# EAGLE board mainboard edited newer edit removed most of the synth (EAGLE 9.5.0)
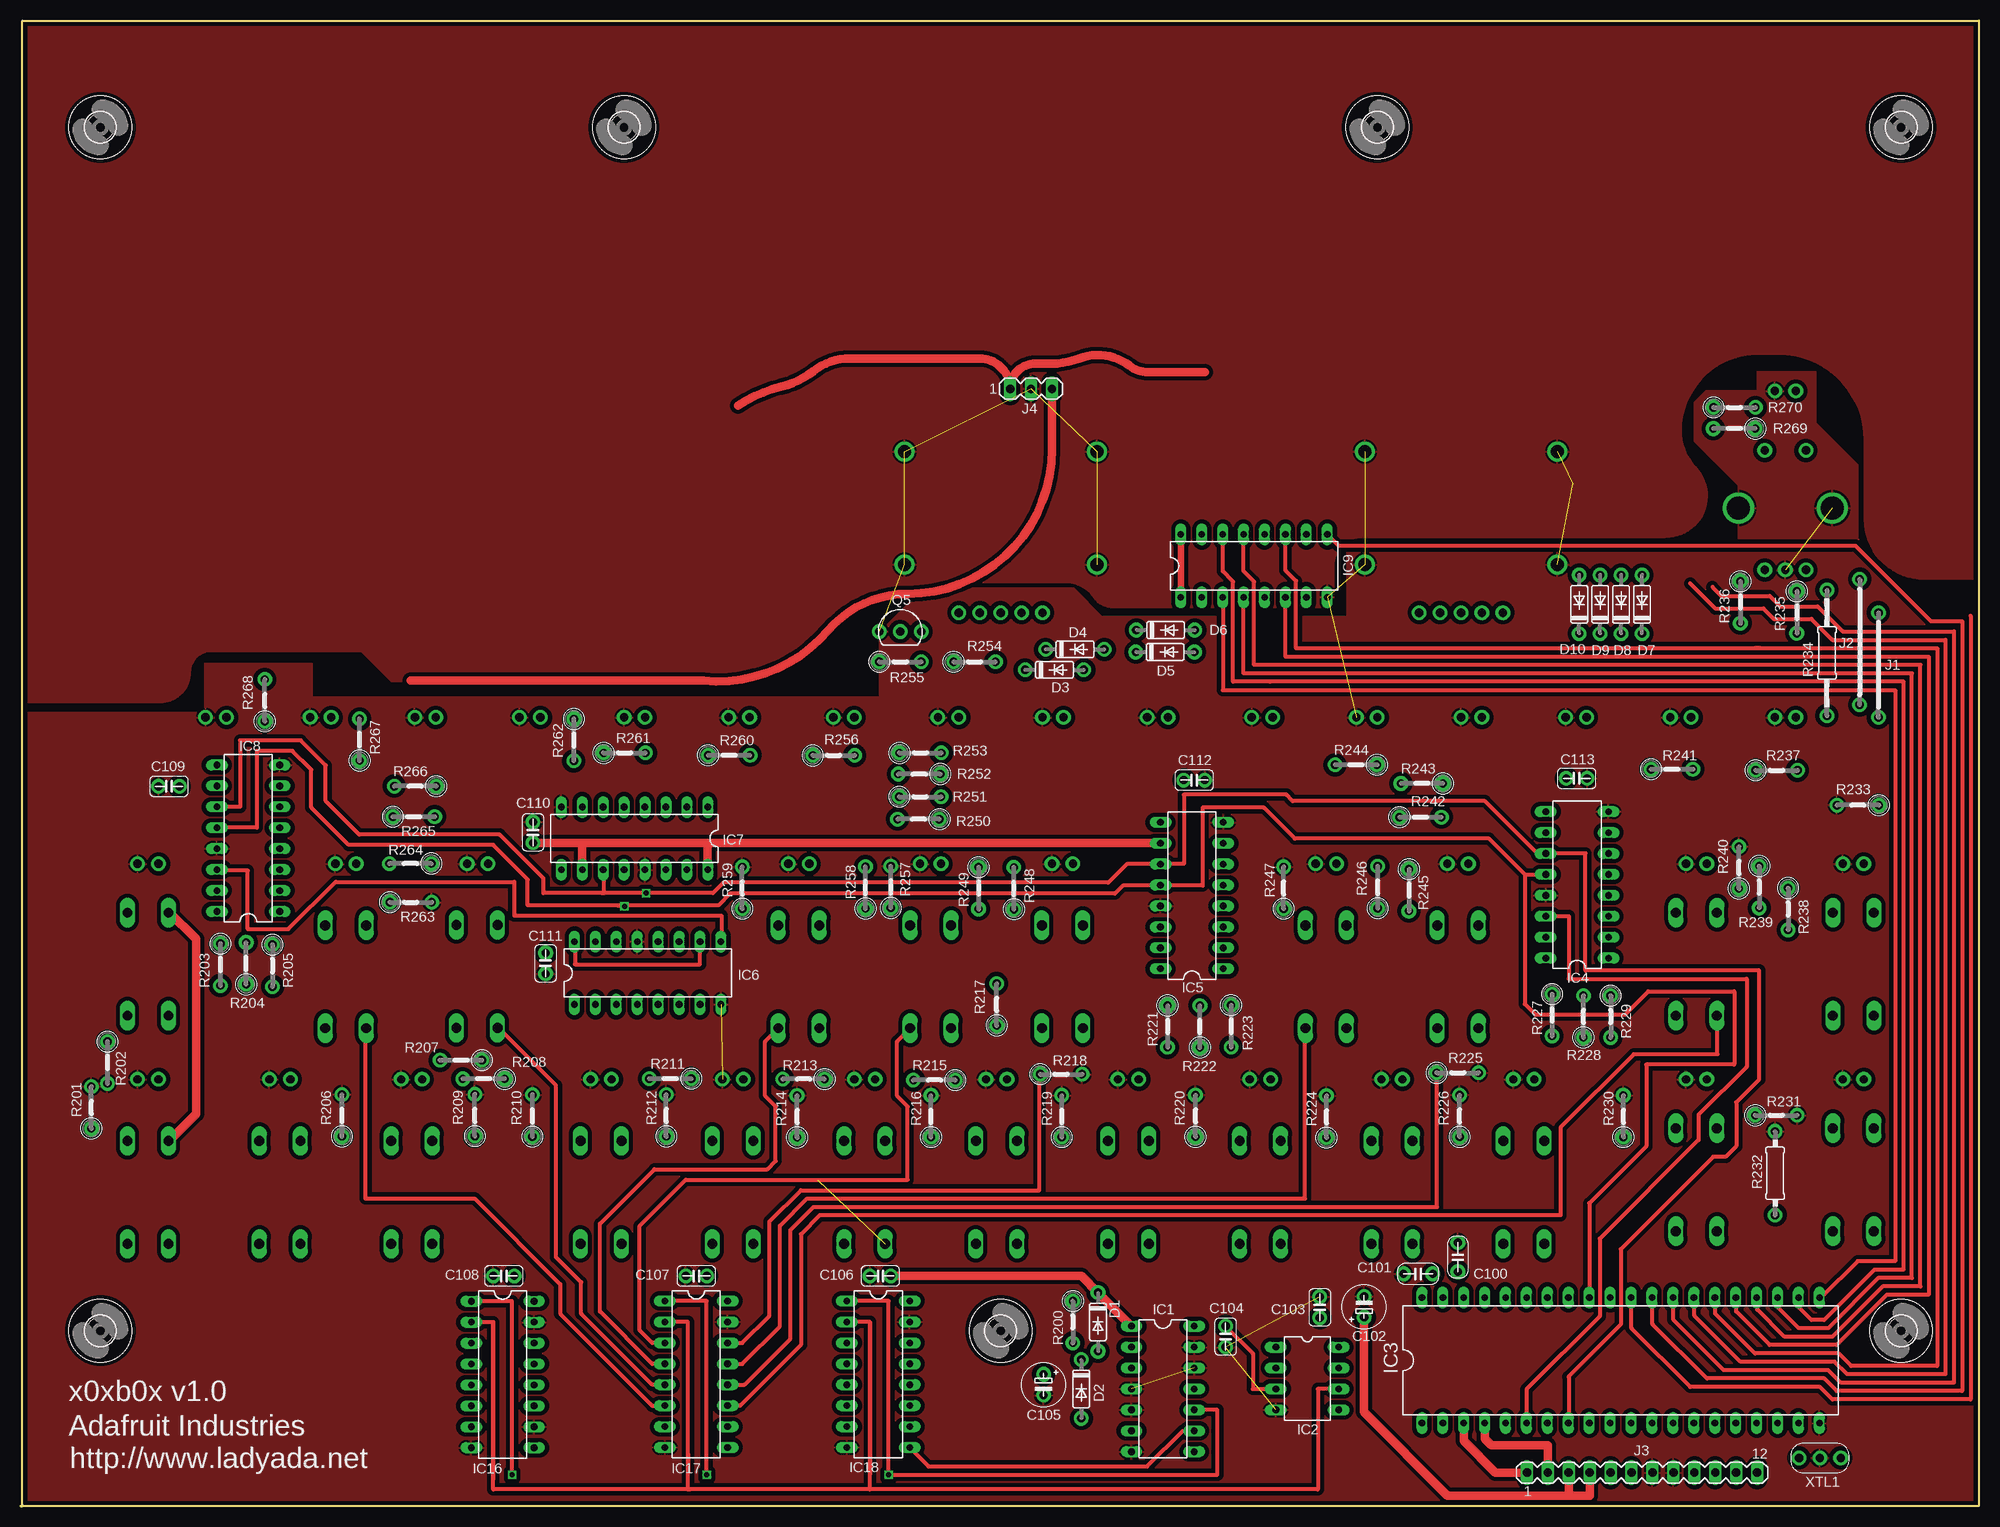
[diagram p3: board, top side]
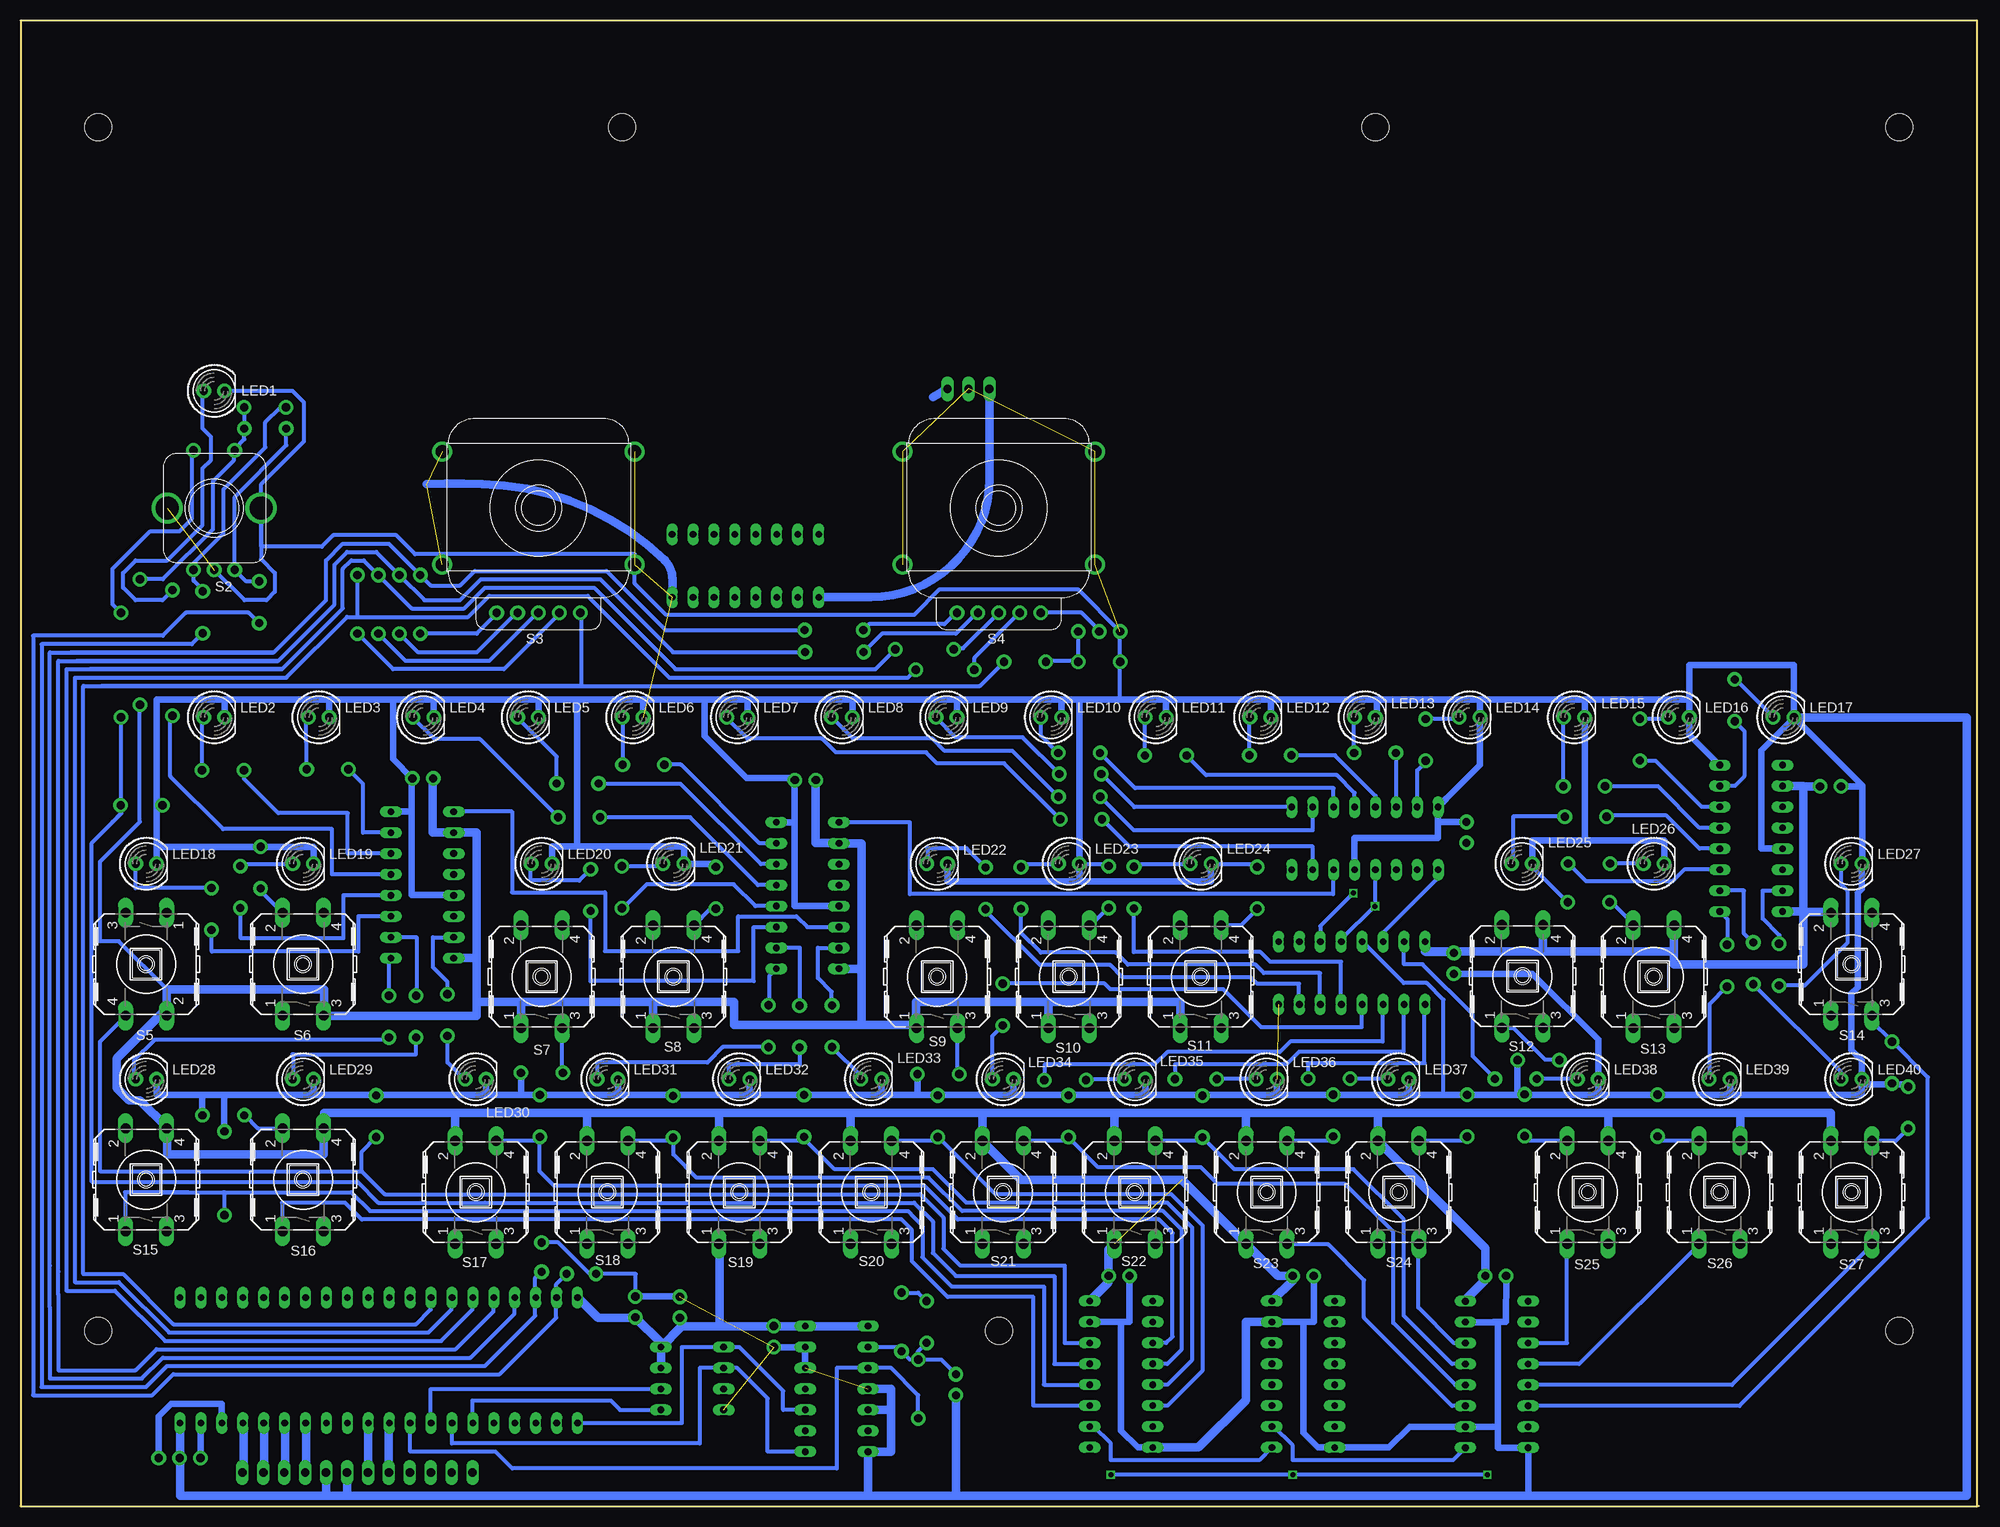
[diagram p4: board, bottom side, seen from below]

Size 237.72 x 180.34 mm. Coordinates in mm from the lower left corner, seen from the top.
Outline: 0.23,0 0.23,180.34 237.72,180.34 237.72,0 0.2,0
Outline: 0,0 0.2,0
Outline: 0.2,0 0.2,0.18
Copper layers (1*16): Top 0.035mm / dielectric 1.5mm / Bottom 0.035mm
Design rules "default": minimum track width 10mil, minimum drill 20mil, track to track 10mil, track to pad 10mil, pad to pad 10mil, via to via 10mil, smd to smd 10mil, copper to edge 10mil, drill to drill 10mil, minimum pad ring 10mil, minimum via ring 8mil, stop-mask expansion 4mil, vias tented up to drill 0mil, thermal gap 10mil

## Footprints (pad centres in the part's own frame; a part is rotated, then mirrored left to right if it is on the bottom)
C050-035X075 = drill 1 pad 1.778: 1 -1.778,0; 2 1.778,0
E5-6 = drill 1 pad 1.778: + -1.27,0; - 1.27,0
C050H075X075 = drill 1 pad 1.778: 1 -1.27,0; 2 1.27,0
DO35-10 = drill 1 pad 1.778: A 3.556,0; C -3.556,0
DIL14 = drill 0.813 long: 1 -7.62,-3.81; 2 -5.08,-3.81; 3 -2.54,-3.81; 4 0,-3.81; 5 2.54,-3.81; 6 5.08,-3.81; 7 7.62,-3.81; 8 7.62,3.81; 9 5.08,3.81; 10 2.54,3.81; 11 0,3.81; 12 -2.54,3.81; 13 -5.08,3.81; 14 -7.62,3.81
DIL08 = drill 0.813 long: 1 -3.81,-3.81; 2 -1.27,-3.81; 3 1.27,-3.81; 4 3.81,-3.81; 5 3.81,3.81; 6 1.27,3.81; 7 -1.27,3.81; 8 -3.81,3.81
DIL40 = drill 0.813 long: 1 -24.13,-7.62; 2 -21.59,-7.62; 3 -19.05,-7.62; 4 -16.51,-7.62; 5 -13.97,-7.62; 6 -11.43,-7.62; 7 -8.89,-7.62; 8 -6.35,-7.62; 9 -3.81,-7.62; 10 -1.27,-7.62; 11 1.27,-7.62; 12 3.81,-7.62; 13 6.35,-7.62; 14 8.89,-7.62; 15 11.43,-7.62; 16 13.97,-7.62; 17 16.51,-7.62; 18 19.05,-7.62; 19 21.59,-7.62; 20 24.13,-7.62; 21 24.13,7.62; 22 21.59,7.62; 23 19.05,7.62; 24 16.51,7.62; 25 13.97,7.62; 26 11.43,7.62; 27 8.89,7.62; 28 6.35,7.62; 29 3.81,7.62; 30 1.27,7.62; 31 -1.27,7.62; 32 -3.81,7.62; 33 -6.35,7.62; 34 -8.89,7.62; 35 -11.43,7.62; 36 -13.97,7.62; 37 -16.51,7.62; 38 -19.05,7.62; 39 -21.59,7.62; 40 -24.13,7.62
DIL16 = drill 0.813 long: 1 -8.89,-3.81; 2 -6.35,-3.81; 3 -3.81,-3.81; 4 -1.27,-3.81; 5 1.27,-3.81; 6 3.81,-3.81; 7 6.35,-3.81; 8 8.89,-3.81; 9 8.89,3.81; 10 6.35,3.81; 11 3.81,3.81; 12 1.27,3.81; 13 -1.27,3.81; 14 -3.81,3.81; 15 -6.35,3.81; 16 -8.89,3.81
12 = drill 1 pad 1.778: 1 -6.35,0; 2 6.35,0
15 = drill 1 pad 1.778: 1 -7.62,0; 2 7.62,0
MA12-1 = drill 1.016 long: 1 -13.97,0; 2 -11.43,0; 3 -8.89,0; 4 -6.35,0; 5 -3.81,0; 6 -1.27,0; 7 1.27,0; 8 3.81,0; 9 6.35,0; 10 8.89,0; 11 11.43,0; 12 13.97,0
MA03-1 = drill 1.016 long: 1 -2.54,0; 2 0,0; 3 2.54,0
LED5MM = drill 1 pad 1.778: A -1.27,0; K 1.27,0
2SC536F = drill 1 pad 1.778: 1 2.54,0; 2 0,0; 3 -2.54,0
0207/5V = drill 1 pad 1.778: 1 -2.54,0; 2 2.54,0
0207/10 = drill 1 pad 1.778: 1 -5.08,0; 2 5.08,0
0207/15 = drill 1 pad 1.778: 1 -7.62,0; 2 7.62,0
PEC11-S = drill 1 pad 1.778: A -2.5,-7.5; B 2.5,-7.5; C 0,-7.5; SW1 -2.5,7; SW2 2.5,7 | drill 2.8: P$1 5.7,0; P$2 -5.7,0
GH3074 = drill 1 pad 1.778: C 5.08,-12.7; P$1 2.54,-12.7; P$2 0,-12.7; P$4 -2.54,-12.7; P$8 -5.08,-12.7 | drill 1.6: MT1 -11.684,6.858; MT2 -11.684,-6.858; MT3 11.684,-6.858; MT4 11.684,6.858
B3F-40XX = drill 1.194 long: 1 -6.248,2.489; 2 6.248,2.489; 3 -6.248,-2.489; 4 6.248,-2.489
1,3 = hole 3.302: 0,0
2SC2021 = drill 1 pad 1.778: 1 -2.54,0; 2 0,0; 3 2.54,0

## Placement (x,y rotation side)
C100  .001  [C050-035X075]  174.47,30.23 270 top
C101  .001  [C050-035X075]  169.65,28.19 0 top
C102  100/10  [E5-6]  163.09,24.18 90 top
C103  .1  [C050H075X075]  157.71,24.13 90 top
C104  .1  [C050H075X075]  146.28,20.57 90 top
C105  1/50  [E5-6]  124.18,14.73 270 top
C106  .1  [C050H075X075]  104.37,27.94 0 top
C107  .1  [C050H075X075]  82.02,27.94 0 top
C108  .1  [C050H075X075]  58.65,27.94 0 top
C109  .1  [C050H075X075]  18.01,87.38 0 top
C110  .1  [C050H075X075]  62.2,81.79 270 top
C111  .1  [C050H075X075]  63.73,65.89 90 top
C112  .1  [C050H075X075]  142.47,88.14 180 top
C113  .1  [C050H075X075]  188.9,88.34 180 top
D1  1N4148  [DO35-10]  130.78,22.35 270 top
D2  1N4148  [DO35-10]  128.75,14.22 270 top
D3  1N4148  [DO35-10]  125.5,101.52 0 top
D4  1N4148  [DO35-10]  127.99,104.01 0 top
D5  1N4148  [DO35-10]  138.94,103.68 0 top
D6  1N4148  [DO35-10]  138.99,106.35 0 top
D7  1N4148  [DO35-10]  196.82,109.47 90 top
D8  1N4148  [DO35-10]  194.28,109.47 90 top
D9  1N4148  [DO35-10]  191.74,109.47 90 top
D10  1N4148  [DO35-10]  189.2,109.47 90 top
IC1  74126N  [DIL14]  138.66,14.22 270 top
IC2  AT25P  [DIL08]  156.18,15.49 270 top
IC3  MEGA162P  [DIL40]  194.23,17.7 0 top
IC4  74HC595N  [DIL16]  188.95,75.41 90 top
IC5  74HC595N  [DIL16]  142.19,74.12 90 top
IC6  74HC595N  [DIL16]  76.12,64.72 0 top
IC7  74HC595N  [DIL16]  74.52,81.05 180 top
IC8  74HC595N  [DIL16]  27.64,81.08 90 top
IC9  4174P  [DIL16]  149.73,114.15 0 top
IC16  74HC165N  [DIL16]  58.52,15.98 270 top
IC17  74HC165N  [DIL16]  82.02,16 270 top
IC18  74HC165N  [DIL16]  104.11,16 270 top
J1  J12MM  [12]  225.53,102.11 270 top
J2  J15MM  [15]  223.24,104.9 270 top
J3  [MA12-1]  196.82,4.06 0 top
J4  [MA03-1]  122.66,135.64 0 top
LED1  [LED5MM]  214.22,135.38 0 bottom
LED2  [LED5MM]  214.22,95.76 0 bottom
LED3  [LED5MM]  201.52,95.76 0 bottom
LED4  [LED5MM]  188.82,95.76 0 bottom
LED5  [LED5MM]  176.12,95.76 0 bottom
LED6  [LED5MM]  163.42,95.76 0 bottom
LED7  [LED5MM]  150.72,95.76 0 bottom
LED8  [LED5MM]  138.02,95.76 0 bottom
LED9  [LED5MM]  125.32,95.76 0 bottom
LED10  [LED5MM]  112.62,95.76 0 bottom
LED11  [LED5MM]  99.92,95.76 0 bottom
LED12  [LED5MM]  87.22,95.76 0 bottom
LED13  [LED5MM]  74.52,95.76 0 bottom
LED14  [LED5MM]  61.82,95.76 0 bottom
LED15  [LED5MM]  49.12,95.76 0 bottom
LED16  [LED5MM]  36.42,95.76 0 bottom
LED17  [LED5MM]  23.72,95.76 0 bottom
LED18  [LED5MM]  222.48,77.98 0 bottom
LED19  [LED5MM]  203.43,77.98 0 bottom
LED20  [LED5MM]  174.47,77.98 0 bottom
LED21  [LED5MM]  158.47,77.98 0 bottom
LED22  [LED5MM]  126.47,77.98 0 bottom
LED23  [LED5MM]  110.46,77.98 0 bottom
LED24  [LED5MM]  94.46,77.98 0 bottom
LED25  [LED5MM]  55.47,77.98 0 bottom
LED26  [LED5MM]  39.47,77.98 0 bottom
LED27  [LED5MM]  15.47,77.98 0 bottom
LED28  [LED5MM]  222.48,51.82 0 bottom
LED29  [LED5MM]  203.43,51.82 0 bottom
LED30  [LED5MM]  182.47,51.82 0 bottom
LED31  [LED5MM]  166.47,51.82 0 bottom
LED32  [LED5MM]  150.47,51.82 0 bottom
LED33  [LED5MM]  134.47,51.82 0 bottom
LED34  [LED5MM]  118.47,51.82 0 bottom
LED35  [LED5MM]  102.46,51.82 0 bottom
LED36  [LED5MM]  86.46,51.82 0 bottom
LED37  [LED5MM]  70.46,51.82 0 bottom
LED38  [LED5MM]  47.47,51.82 0 bottom
LED39  [LED5MM]  31.47,51.82 0 bottom
LED40  [LED5MM]  15.47,51.82 0 bottom
Q5  2SC536F  [2SC536F]  106.78,106.17 0 top
R200  1M  [0207/5V]  127.74,22.35 270 top
R201  10K  [0207/5V]  8.59,48.39 90 top
R202  10K  [0207/5V]  10.54,53.85 270 top
R203  10K  [0207/5V]  24.26,65.74 270 top
R204  10K  [0207/5V]  27.38,65.89 90 top
R205  10K  [0207/5V]  30.58,65.61 270 top
R206  10K  [0207/5V]  39.01,47.42 90 top
R207  10K  [0207/5V]  53.47,54.13 180 top
R208  10K  [0207/5V]  56.21,51.87 180 top
R209  10K  [0207/5V]  55.14,47.45 90 top
R210  10K  [0207/5V]  62.13,47.4 90 top
R211  10K  [0207/5V]  78.87,51.89 180 top
R212  10K  [0207/5V]  78.38,47.42 90 top
R213  10K  [0207/5V]  95.05,51.84 180 top
R214  10K  [0207/5V]  94.26,47.29 90 top
R215  10K  [0207/5V]  110.92,51.71 180 top
R216  10K  [0207/5V]  110.52,47.32 90 top
R217  10K  [0207/5V]  118.49,60.88 90 top
R218  10K  [0207/5V]  126.31,52.43 0 top
R219  10K  [0207/5V]  126.39,47.32 90 top
R220  10K  [0207/5V]  142.62,47.37 90 top
R221  10K  [0207/5V]  139.22,58.24 270 top
R222  10K  [0207/5V]  143.15,58.22 90 top
R223  10K  [0207/5V]  146.94,58.27 270 top
R224  10K  [0207/5V]  158.52,47.27 90 top
R225  10K  [0207/5V]  174.45,52.6 0 top
R226  10K  [0207/5V]  174.68,47.37 90 top
R227  10K  [0207/5V]  185.9,59.61 270 top
R228  10K  [0207/5V]  189.71,59.44 90 top
R229  10K  [0207/5V]  193.01,59.44 270 top
R230  10K  [0207/5V]  194.56,47.32 90 top
R231  10K  [0207/5V]  213.11,47.45 0 top
R232  10K  [0207/10]  212.98,40.41 90 top
R233  10K  [0207/5V]  223.04,85.09 180 top
R234  10K  [0207/15]  219.28,103.58 90 top
R235  220k  [0207/5V]  215.62,108.51 270 top
R236  220k  [0207/5V]  208.76,109.73 270 top
R237  10K  [0207/5V]  213.16,89.33 0 top
R238  10K  [0207/5V]  214.55,72.49 270 top
R239  10K  [0207/5V]  211.05,75.16 270 top
R240  10K  [0207/5V]  208.58,77.52 90 top
R241  10K  [0207/5V]  200.46,89.46 0 top
R242  10K  [0207/5V]  169.93,83.64 0 top
R243  10K  [0207/5V]  170.1,87.73 180 top
R244  10K  [0207/5V]  162.1,89.99 180 top
R245  10K  [0207/5V]  168.53,74.78 270 top
R246  10K  [0207/5V]  164.74,75.13 90 top
R247  10K  [0207/5V]  153.31,75.06 90 top
R248  10K  [0207/5V]  120.57,75.01 90 top
R249  10K  [0207/5V]  116.28,75.03 270 top
R250  10K  [0207/5V]  108.99,83.39 180 top
R251  10K  [0207/5V]  109.19,86.11 0 top
R252  10K  [0207/5V]  109.09,88.87 180 top
R253  10K  [0207/5V]  109.22,91.44 0 top
R254  10K  [0207/5V]  115.8,102.49 0 top
R255  10K  [0207/5V]  106.78,102.49 0 top
R256  10K  [0207/5V]  98.7,91.14 0 top
R257  10K  [0207/5V]  105.64,75.16 90 top
R258  10K  [0207/5V]  102.57,75.08 90 top
R259  10K  [0207/5V]  87.6,75.06 90 top
R260  10K  [0207/5V]  86,91.16 0 top
R261  10K  [0207/5V]  73.3,91.44 0 top
R262  10K  [0207/5V]  67.16,93.01 270 top
R263  10K  [0207/5V]  47.37,73.3 0 top
R264  10K  [0207/5V]  47.32,78 180 top
R265  10K  [0207/5V]  47.73,83.69 0 top
R266  10K  [0207/5V]  47.9,87.4 180 top
R267  10K  [0207/5V]  41.15,93.04 90 top
R268  10K  [0207/5V]  29.64,97.82 90 top
R269  10K  [0207/5V]  208.03,130.81 180 top
R270  10K  [0207/5V]  208.05,133.38 0 top
S2  PEC11-S  [PEC11-S]  214.22,121.16 0 bottom
S3  GH3074  [GH3074]  174.85,121.16 0 bottom
S4  GH3074  [GH3074]  118.97,121.16 0 bottom
S5  [B3F-40XX]  222.48,65.79 270 bottom
S6  [B3F-40XX]  203.43,65.79 90 bottom
S7  [B3F-40XX]  174.47,64.26 90 bottom
S8  [B3F-40XX]  158.47,64.26 90 bottom
S9  [B3F-40XX]  126.47,64.26 90 bottom
S10  [B3F-40XX]  110.46,64.26 90 bottom
S11  [B3F-40XX]  94.46,64.26 90 bottom
S12  [B3F-40XX]  55.4,64.31 90 bottom
S13  [B3F-40XX]  39.47,64.26 90 bottom
S14  [B3F-40XX]  15.47,65.79 90 bottom
S15  [B3F-40XX]  222.48,39.62 90 bottom
S16  [B3F-40XX]  203.43,39.62 90 bottom
S17  [B3F-40XX]  182.47,38.1 90 bottom
S18  [B3F-40XX]  166.47,38.1 90 bottom
S19  [B3F-40XX]  150.47,38.1 90 bottom
S20  [B3F-40XX]  134.47,38.1 90 bottom
S21  [B3F-40XX]  118.47,38.1 90 bottom
S22  [B3F-40XX]  102.46,38.1 90 bottom
S23  [B3F-40XX]  86.46,38.1 90 bottom
S24  [B3F-40XX]  70.46,38.1 90 bottom
S25  [B3F-40XX]  47.47,38.1 90 bottom
S26  [B3F-40XX]  31.47,38.1 90 bottom
S27  [B3F-40XX]  15.47,38.1 90 bottom
U$2  [1,3]  228.27,21.29 0 top
U$23  [1,3]  228.27,167.39 0 top
U$24  [1,3]  9.68,167.39 0 top
U$25  [1,3]  9.68,21.29 0 top
U$27  [1,3]  118.97,21.29 0 top
U$28  [1,3]  73.25,167.39 0 top
U$29  [1,3]  164.69,167.39 0 top
XTL1  2SC2021R  [2SC2021]  218.41,5.84 0 top

## Tracks (layer width: path | path; a pad name or v marks a point on that pad's centre or on a via)
+5.333V
  Top 0.762: 140.84,110.29 arc-90 140.79,110.24 arc90 140.84,110.29 | 140.84,110.29 IC9.1 IC9.16
  Top 1.016: 143.74,137.67 136.88,137.67 arc-40 134.59,138.43 arc60 128.5,139.32 arc-22 125.2,138.68 123.16,138.68 arc90 J4.1 arc90 116.43,139.32 100.69,139.32 arc38 96.24,137.79 arc-24 92.3,135.89 arc20 87.1,133.6
  Bottom 0.508: IC9.1 140.84,110.44
  Bottom 0.762: 140.92,110.36 IC9.1
  Bottom 1.016: 134.47,110.36 arc90 134.49,110.39 arc-90 134.47,110.36 | 134.47,110.36 140.92,110.36 | J4.1 120.12,124.71 arc90 134.47,110.36
+5V  (1 unrouted)
  Top 0.508: IC6.10 82.47,65.79 67.28,65.79 67.28,68.53 | 67.28,68.53 67.28,68.58 | IC6.16 67.28,68.53 | IC2.3 149.58,14.22 149.58,18.54 C104.2
  Top 0.762: 138.56,80.54 138.38,80.54 IC5.10
  Top 1.016: 138.38,80.52 138.4,80.52 | IC5.10 138.38,80.52 | IC7.16 83.41,80.52 84.3,80.52 | 138.38,80.52 84.3,80.52 | 84.3,80.52 68.05,80.52 | 68.05,80.52 C110.2 | IC7.10 68.17,80.52 68.05,80.52 | 18.01,44.3 18.01,44.2 | S27.2 18.01,44.3 | 18.01,44.3 21.31,47.6 21.31,68.83 18.01,72.14 17.96,72.08 S14.2 | IC1.1 D1.C 128.75,27.94 C106.2 | 184.38,1.27 173.2,1.27 163.04,11.43 163.04,22.86 C102.+ | 184.38,1.27 185.39,1.27 | J3.3 187.93,1.27 186.54,1.27 | 184.38,1.27 186.54,1.27 | J3.4 190.47,1.27 186.54,1.27
  Bottom 0.508: J2.2 223.24,83.06 228.07,78.23 228.07,68.58 225.78,68.58 219.94,62.74 | C111.2 63.73,67.06 67.23,67.06 67.23,67.31 | IC1.14 139.93,21.84 | R200.1 128.75,25.91 D1.C
  Bottom 0.762: S16.4 200.94,45.82 200.84,45.82
  Bottom 1.016: 170.15,25.4 170.1,25.4 IC3.40 167.64,22.86 163.04,22.86 | IC2.8 IC2.7 | 200.89,45.87 200.89,45.72 | 200.89,45.87 S16.4 200.94,42.67 219.94,42.67 219.94,45.87 | 188.44,47.75 200.89,47.75 200.89,45.87 | 188.44,47.75 166.6,47.75 | 166.6,47.75 150.6,47.75 | 150.6,47.75 135.61,47.75 | 135.61,47.75 120.12,47.75 | 120.12,47.75 104.37,47.75 | 104.37,47.75 87.86,47.75 | 87.86,47.75 71.86,47.75 | 71.86,47.75 44.42,47.75 | 44.42,47.75 28.42,47.75 | 28.42,47.75 18.01,47.75 | S17.2 184.96,47.75 188.44,47.75 | S18.2 168.96,47.75 166.6,47.75 | S19.2 152.96,47.75 150.6,47.75 | S20.2 136.96,47.75 135.61,47.75 | 120.12,47.75 120.95,47.75 S21.2 121.03,44.35 | S22.2 104.95,47.75 104.37,47.75 | S23.2 88.95,47.75 87.86,47.75 | 71.86,47.75 72.95,47.75 S24.2 59.92,31.32 C108.2 59.97,27.38 62.46,24.89 62.43,24.87 IC16.16 | S25.4 44.98,47.75 44.42,47.75 | S26.4 28.98,47.75 28.42,47.75 | 219.94,45.97 219.94,45.87 | 219.94,45.87 S15.4 219.99,45.92 219.94,45.97 | 219.99,62.74 S5.2 | S6.3 200.89,59.54 | 219.99,62.74 219.94,62.74 200.89,62.74 200.89,59.54 | 160.25,61.21 151.1,61.21 151.1,58.42 135.61,58.42 | 135.61,58.42 129.01,58.42 129.01,58.01 | S11.1 96.95,61.21 111.23,61.21 | 129.01,58.01 129.01,57.91 | 129.01,58.01 S9.1 | 111.23,61.21 129.01,61.21 129.01,58.01 | S10.1 112.95,61.21 111.23,61.21 | S8.1 160.96,61.21 160.25,61.21 | S7.1 176.96,61.21 176,61.21 | 176,61.21 160.25,61.21 | 200.89,59.54 182.35,59.54 | 182.35,59.54 182.35,66.52 | 182.35,59.54 182.35,61.21 176,61.21 | 182.35,66.52 IC4.16 | 185.14,81.79 IC4.10 | 182.35,66.52 182.35,81.79 185.14,81.79 | 187.68,88.34 187.68,88.39 | 187.68,88.34 C113.2 | 185.14,81.79 187.68,81.79 187.68,88.34
  Bottom 1.016: 219.99,62.74 219.99,60.4 226.03,54.36 226.03,50.8 224.51,49.28 223.24,49.28 219.94,45.97 | S13.4 37.06,70.51 37.06,67.31 | 37.06,67.31 37.06,65.79 21.31,65.79 21.31,72.03 | S12.4 52.91,67.31 51.79,67.31 | 37.06,67.31 51.79,67.31 | IC6.16 67.23,67.31 51.79,67.31 | IC5.16 135.61,65.23 135.61,65.02 | 135.61,58.42 135.61,65.02 | 135.61,65.02 135.61,80.47 IC5.10 138.38,80.52 141.2,80.52 C112.2 | IC8.10 21.31,87.43 21.31,87.38 | 21.31,72.03 21.31,87.38 | 21.31,87.38 C109.2 | IC8.16 21.31,72.19 21.31,72.03 | S27.2 18.01,44.35 18.01,47.75 | 18.01,47.75 17.96,47.75 | S14.2 18.01,72.08 18.01,72.14 21.21,72.14 21.31,72.03 | 157.45,21.84 IC2.8 | IC1.1 IC1.14 C104.2 154.66,21.84 | IC17.16 83.29,27.43 C107.2 85.06,27.94 88.98,31.85 | C103.1 157.45,22.86 157.45,21.84 | 163.04,22.86 C102.+ | IC2.8 159.99,19.81 163.04,22.86 | 88.98,31.85 S23.1 | S22.1 105.64,31.17 C106.2 105.64,27.18 IC18.16 | 154.66,21.84 157.45,21.84 | 152.88,31.85 152.88,32 | 152.88,31.85 S19.1 | 154.66,21.84 152.88,21.84 152.88,31.85 | 88.98,31.85 96.75,39.62 116.31,39.62 121.03,44.35 | 121.03,44.35 121.13,44.45
+12V
  Top 1.016: J4.3 125.2,128.27 arc-90 107.67,110.74 arc49 98.02,106.3 arc-55 82.91,100.2 47.35,100.2
  Bottom 1.016: J4.3 126.97,134.62
ACCENT
  Top 0.508: 205.38,111.58 206.48,110.49 212.32,110.49 213.59,109.22 218.16,109.22 221.21,106.17 234.67,106.17 234.67,14.99 231.88,14.99 220.95,14.99 219.43,16.51 206.73,16.51 200.63,22.61 200.63,25.38 | 200.63,25.38 200.63,25.4 | 200.63,25.38 IC3.28
DINSYNC1
  Bottom 0.762: J3.12 210.79,4.83
  Bottom 1.016: 210.67,10.08 210.67,10.16 | 210.67,10.08 IC3.17 | 210.79,4.83 210.67,4.83 210.67,10.08
DINSYNC2
  Bottom 1.016: 208.13,10.08 208.13,10.16 | 208.13,10.08 IC3.16 | J3.11 208.13,4.06 208.13,10.08
DINSYNC3
  Bottom 0.762: J3.10 205.71,4.83
  Bottom 1.016: 205.59,10.08 205.59,10.16 | 205.59,10.08 IC3.15 | 205.71,4.83 205.59,4.83 205.59,10.08
DINSYNC4
  Bottom 0.762: J3.9 203.17,4.83
  Bottom 1.016: 203.05,10.08 203.05,10.16 | 203.05,10.08 IC3.14 | 203.17,4.83 203.05,4.83 203.05,10.08
GATE
  Top 0.508: 195.55,25.38 195.55,25.4 | 195.55,25.38 IC3.30 | 195.55,25.38 195.55,21.59 202.67,14.48 218.41,14.48 219.94,12.95 236.7,12.95 236.7,108.08
GND  (16 unrouted)
  Bottom 0.508: 105.26,97.89 105.26,97.92 104.24,97.92 | 155.98,77.98 155.98,77.88 153.31,77.88 R247.2 | 107.16,97.89 107.16,98.04 104.24,98.04 R255.1 Q5.3 109.32,111.25 126.21,111.25 129.26,108.2 159.36,108.2 163.17,112.01 163.17,115.57 189.84,115.57 192.13,117.86 199.75,117.86 201.14,116.46 208.51,116.46 208.51,119.76 208.52,119.76 | 221.21,84.07 221.21,85.09 R233.2 | IC3.20 218.41,10.08 XTL1.2 | 138.4,72.9 138.4,72.87 141.58,72.87 | IC16.15 62.31,22.35 61.7,22.35 | C100.1 172.44,32 168.63,28.19 C101.1 163.04,28.19 163.04,25.45 | 163.04,25.45 163.04,25.4 | C102.- 163.04,25.45 | 141.58,72.85 141.58,72.87 | 141.58,72.87 141.58,72.9 | R263.2 54.2,77.6 LED25.K | R259.2 87.99,77.98 LED24.K | R257.2 105.92,77.98 LED23.K | R240.2 205.59,80.06 205.59,80.01 | IC6.13 69.82,63.5 67.03,63.5 65,61.47 65,50.04 67.54,50.04 67.54,49.91 | 208.52,119.76 208.52,114.95 206.86,113.28 206.86,111 207.87,109.98 210.54,109.98 S2.C | 208.52,119.76 S2.P$1 208.51,121.16 208.51,124.08 203.3,129.29 203.3,133.99 204.7,135.38 LED1.K
  Bottom 0.762: LED2.K 212.95,97.89 214.3,97.89 | 59.77,97.89 72.21,97.89 | 46.2,97.89 59.77,97.89 | 36.04,97.89 46.2,97.89 | 36.04,97.89 35.13,97.89 35.13,102.11 22.45,102.11 LED17.K 22.43,95.76 | 72.21,97.89 83.79,97.89 | 83.79,97.89 85.37,97.89 | 85.37,97.89 97.46,97.89 | 97.46,97.89 97.61,97.89 | 97.61,97.89 105.26,97.89 107.16,97.89 109.19,97.89 | 109.19,97.89 110.16,97.89 | 110.16,97.89 110.57,97.89 | 110.57,97.89 122.35,97.89 | 122.35,97.89 123.06,97.89 | 123.06,97.89 136.02,97.89 | 136.02,97.89 148.72,97.89 | 148.72,97.89 161.42,97.89 | 161.42,97.89 170.15,97.89 | 170.15,97.89 174.12,97.89 | 174.12,97.89 186.46,97.89 | 186.46,97.89 192.51,97.89 | 192.51,97.89 193.01,97.89 | 198.6,97.89 214.3,97.89 | LED3.K 200.25,97.89 198.6,97.89 | LED4.K 187.55,97.89 186.46,97.89 | LED5.K 174.85,97.89 174.12,97.89 | LED6.K 162.15,97.89 161.42,97.89 | LED7.K 149.45,97.89 148.72,97.89 | LED8.K 136.75,97.89 136.02,97.89 | 123.06,97.89 124.05,97.89 | 110.57,97.89 111.35,97.89 | 97.61,97.89 97.61,97.84 98.65,97.84 | 85.37,97.89 85.95,97.89 | LED13.K 73.25,95.71 73.08,95.71 73.08,97.89 72.21,97.89 | 59.77,97.89 60.55,97.89 LED14.K 60.55,89.97 64.71,85.81 | 46.2,97.89 47.85,97.89 LED15.K 47.83,95.76 47.83,80.82 47.32,80.82 | 36.04,97.89 35.15,97.89 LED16.K 35.15,93.6 32.23,90.68 | 32.23,90.68 31.42,89.86 | IC8.13 26.44,79.81 26.44,91.75 22.43,95.76 | LED27.K 14.2,77.93 | LED26.K 38.2,80.82 47.32,80.82 | LED25.K 54.2,80.82 47.32,80.82 | LED22.K 125.2,75.84 110.11,75.84 | 110.11,75.84 109.19,75.84 109.19,75.95 | 109.19,97.89 LED23.K 109.19,75.95 | LED24.K 93.19,75.84 110.11,75.84 | 109.19,75.95 109.09,75.95 | LED21.K 157.2,80.06 168.33,80.06 | 168.33,80.06 170.15,80.06 170.15,97.89
  Bottom 0.762: LED20.K 173.2,80.06 168.33,80.06 | 85.95,97.89 LED12.K | 83.79,97.89 85.95,97.89 | 97.46,97.89 97.46,97.84 98.65,97.84 | 98.65,97.84 LED11.K | 110.16,97.89 110.16,97.84 111.35,97.84 LED10.K | 122.35,97.89 122.35,97.84 124.05,97.84 LED9.K | LED21.K 157.25,77.98 | LED21.K 155.98,77.98 153.31,77.98 | 193.01,97.89 198.6,97.89 | 193.01,97.89 192.76,97.89 | 221.21,80.01 221.21,80.16 | 64.71,85.81 65.63,84.89 | IC7.13 75.79,81.1 65.66,81.1 65.66,83.06 | 65.66,83.06 65.66,84.86 65.63,84.84 65.61,84.84 | LED27.K 14.17,78 14.15,78 14.15,87.48 14.38,87.71 | 14.38,87.71 22.43,95.76 | 214.3,97.89 221.21,97.89 221.21,84.07 | 221.21,80.01 LED18.K | 221.21,84.07 221.21,86.11 | 65.66,83.06 C110.1 | 190.22,88.34 190.22,88.39 | 190.22,88.34 C113.1 192.51,90.68 192.51,97.89 | 190.22,84.3 IC4.8 | 190.22,88.34 190.22,84.3 | IC4.13 185.14,74.17 190.22,74.17 190.22,84.3 | IC5.8 143.74,83.01 143.74,83.06 | C112.1 143.74,83.06 | IC5.13 141.58,72.85 143.74,72.85 143.74,83.06 | 161.42,97.89 154.66,97.89 154.66,93.47 149.58,88.39 143.74,88.39 | 65.61,84.84 65.51,84.84 | 65.61,84.84 IC7.8 64.74,85.75 64.74,85.85 64.71,85.81 | 14.38,87.71 14.45,87.71 14.45,87.38 C109.1 | 32.23,90.68 IC8.8 | C104.1 IC1.13 IC1.12 | 104.62,22.35 104.11,22.35 104.11,9.14 102.08,7.11 IC18.8 | 104.62,22.35 IC18.15 | C106.1 103.1,22.35 104.62,22.35 | 82.27,22.35 82.02,22.35 82.02,8.89 80.24,7.11 IC17.8 71.6,7.11 69.09,9.63 IC16.10 58.39,9.63 58.39,9.14 | 82.27,22.35 IC17.15 | C107.1 80.75,22.35 82.27,22.35 | 58.9,22.33 58.65,22.33 | 58.9,22.33 IC16.15 | 54.58,7.11 54.71,7.11 IC16.8 | 58.9,22.33 58.9,22.35 58.39,22.35 | C108.1 57.43,22.35 58.39,22.35 | 58.39,9.14 58.39,7.11
  Bottom 0.762: 58.39,10.41 58.39,9.14 | 58.39,10.41 58.39,22.35 | 157.71,25.45 C102.- | 133.32,1.27 134.85,1.27 | IC16.8 54.71,1.27 53.57,1.27 | IC16.8 58.39,7.09 58.39,10.41 | LED19.K 202.16,80.01 205.59,80.01 221.21,80.01 | 221.21,84.07 221.21,80.01 | 14.2,50.04 14.2,49.91 31.22,49.91 | 14.2,50.04 14.2,51.18 | 194.41,49.91 180.19,49.91 | 180.19,49.91 178.79,49.91 | 178.79,49.91 177.9,49.91 | 177.9,49.91 R226.2 164.69,49.91 | 164.69,49.91 160.38,49.91 | 160.38,49.91 150.09,49.91 | 134.34,49.91 R220.2 150.09,49.91 | 134.34,49.91 130.15,49.91 | 130.15,49.91 128.5,49.91 | 128.5,49.91 116.43,49.91 | 116.43,49.91 112.37,49.91 | 112.37,49.91 102.21,49.91 | 102.21,49.91 95.73,49.91 | 95.73,49.91 84.56,49.91 | 84.56,49.91 79.98,49.91 | 79.98,49.91 70.08,49.91 | 70.08,49.91 67.54,49.91 63.73,49.91 | 63.73,49.91 58.52,49.91 | 58.52,49.91 57.38,49.91 | 57.38,49.91 56.49,49.91 | 56.49,49.91 47.09,49.91 | 47.09,49.91 40.36,49.91 | 40.36,49.91 31.22,49.91 | 194.41,49.91 194.56,49.91 R230.2 | LED28.K 221.21,49.91 216.51,49.91 | 214.1,49.91 216.51,49.91 | 214.1,49.91 200.51,49.91 | 200.51,49.91 194.41,49.91 | LED29.K 202.16,49.91 200.51,49.91 | LED31.K 165.2,49.91 164.69,49.91 | R224.2 158.52,49.91 160.38,49.91 | LED32.K 149.2,49.91 150.09,49.91 | LED33.K 133.2,49.91 134.34,49.91 | R219.2 126.39,49.91 128.5,49.91 | LED34.K 117.2,49.91 116.43,49.91 | R216.2 110.52,49.91 112.37,49.91 | LED35.K 101.19,49.91 102.21,49.91 | R214.2 94.26,49.91 95.73,49.91 | LED36.K 85.19,49.91 84.56,49.91 | R212.2 78.38,49.91 79.98,49.91 | LED37.K 69.19,49.91 70.08,49.91 | R210.2 62.13,49.91 63.73,49.91 | R209.2 55.14,49.91 56.49,49.91 | 57.38,49.91 56.34,49.91 | 46.2,51.56 46.2,49.91 47.09,49.91
  Bottom 0.762: R206.2 39.01,49.91 40.36,49.91 | LED39.K 30.2,49.91 31.22,49.91 | R201.2 8.59,51.18 9.37,51.18 | 14.2,51.18 9.37,51.18 | R202.2 10.54,51.18 9.37,51.18 | R232.2 212.98,49.91 214.1,49.91 | R231.2 215.65,49.91 216.51,49.91 | 177.9,49.91 177.04,49.91 | LED30.K 181.2,49.91 180.19,49.91 | R218.2 128.85,49.91 130.15,49.91 | C111.1 54.18,64.62 46.2,56.64 46.2,51.56 | 46.2,51.56 LED38.K | 14.2,51.18 LED40.K | LED40.K 14.2,54.1 15.47,55.37 15.47,62.23 14.71,62.99 14.71,74.42 14.2,74.93 LED27.K | 14.2,50.04 LED40.K | R207.1 56.01,49.91 58.52,49.91 | R225.2 176.99,49.91 178.79,49.91
  Bottom 1.016: IC3.20 218.36,1.27 200.63,1.27 | 122.78,1.27 53.57,1.27 1.5,1.27 1.5,95.76 LED17.K 22.58,95.76 | 122.78,1.27 133.32,1.27 136.75,1.27 | 136.75,1.27 198.09,1.27 | 198.09,1.27 200.63,1.27 | 198.09,1.27 J3.7 | 200.63,1.27 J3.8 | 143.74,88.39 C112.1 | 136.75,1.27 134.85,1.27 IC1.7 132.05,6.6 132.05,11.3 | 132.05,11.3 132.05,11.68 IC1.5 | IC1.4 132.05,14.22 132.05,11.3 | C105.- 124.18,1.27 122.78,1.27 | IC17.15 89,22.35 89,12.83 94.72,7.11 IC18.8 | IC9.8 158.6,112.52 arc-47 159.61,114.94 arc-42 181.71,124.08 arc-3 188.44,124.08
  pour Top (isolate 0.508): 237.72,0 237.72,111.76 232.64,111.76 228.7,111.76 223.88,116.59 222.99,117.47 222.99,123.7 222.99,126.36 218.92,130.43 217.91,131.44 217.91,136.65 217.91,137.67 212.06,137.67 210.79,137.67 210.79,135.38 204.57,135.38 203.17,133.99 203.17,129.29 208.51,123.95 208.51,116.59 204.44,116.59 161.01,116.59 161.01,111.25 161.01,107.95 141.07,107.95 131.29,107.95 127.86,111.38 109.58,111.38 104.24,106.05 104.24,98.17 94.97,98.17 35.41,98.17 35.41,99.95 35.41,102.23 24.1,102.23 22.33,102.23 22.33,96.27 0.23,96.27 0.23,93.47 0.23,0
  pour Top (isolate 0.508): 0.23,180.34 237.72,180.34 237.72,112.52 231.11,112.52 arc-90 223.88,119.76 223.88,129.41 arc90 213.46,139.83 210.79,139.83 arc90 201.52,130.56 arc44 203.3,126.11 arc-134 199.62,117.6 162.79,117.6 arc90 159.36,114.17 159.36,110.24 arc-90 158.22,109.09 132.56,109.09 arc-56 130.4,110.24 arc50 127.23,112.14 114.66,112.14 108.43,110.87 arc2 101.7,109.35 92.56,101.73 85.7,100.08 45.06,100.08 41.38,103.76 23.09,103.76 arc90 20.55,101.22 arc-90 16.87,97.54 4.29,97.54 0.23,97.54
LED_LATCH  (via drill 0.6)
  Top 0.508: 23.83,82.37 23.75,82.37 | 23.83,82.37 IC8.12 | 182.6,76.68 IC4.12 | 138.38,75.34 138.28,75.34 | 138.38,75.34 IC5.12 | 138.38,75.34 143.48,75.34 143.48,84.78 150.9,84.78 154.66,81.03 178.26,81.03 182.6,76.68 | 138.38,75.34 133.81,75.34 132.82,74.35 86.13,74.35 84.71,72.92 72.42,72.92 | 72.42,72.92 61.57,72.92 61.57,76.07 57.38,80.26 39.85,80.26 35.28,84.84 35.28,89.41 32.99,91.69 28.68,91.69 28.68,82.37 23.83,82.37 | 182.6,76.68 182.6,76.71 | 182.6,76.68 182.6,60.96 183.87,59.69 194.79,59.69 197.59,62.48 208,62.48 208,53.59 197.33,53.59 197.33,43.69 190.42,36.78 IC3.32 | v73.3,72.82 73.38,72.9 73.36,72.92 72.42,72.92
  Bottom 0.508: 73.41,72.82 v73.3,72.82 73.38,72.9 | IC7.12 73.25,72.97 73.41,72.82 | IC6.12 77.44,68.58 77.44,68.78 73.41,72.82
MIDI_IN
  Bottom 1.016: IC3.10 193.01,10.08 J3.5
MIDI_OUT
  Bottom 1.016: 195.55,10.08 195.55,10.41 | 195.55,10.08 IC3.11 | J3.6 195.55,10.08
N$23
  Bottom 0.508: R252.2 106.53,88.88 102.51,84.86 IC7.1
N$59
  Bottom 0.508: R254.1 113.13,102.62 109.32,102.62 R255.2 Q5.1
N$78
  Bottom 0.508: R236.1 210.33,112.27 S2.B 211.72,122.52 205.46,128.78 205.46,130.81 R269.2
N$81
  Bottom 0.508: IC4.7 196.16,81.76 196.16,87.68 197.92,89.43 R241.1
N$87
  Top 0.508: IC18.9 110.21,4.83 136.75,4.83 141.07,9.14 IC1.9
N$90
  Bottom 0.508: IC1.2 131.29,19.3 D1.A 129.77,17.78 D2.C | C105.+ 125.96,17.78 D2.C | R200.2 128.75,18.8 D2.C
N$100
  Bottom 0.508: IC4.6 197.99,79.22 197.99,84.12 206.43,84.12 210.59,88.29 210.59,89.36 | 210.59,89.36 210.59,89.41 | 210.59,89.36 R237.1
N$107
  Top 0.508: IC17.5 76.68,14.73 68.05,23.37 68.05,27.18 65,30.23 65,51.05 57.89,58.17 S12.1
  Bottom 0.508: S12.1 56.51,58.06 52.68,54.23 50.9,54.23 50.9,54.15 R207.2
N$129
  Bottom 0.508: 164.69,95.78 164.72,95.81 | LED6.A 164.69,95.78 | R244.1 164.64,95.73 164.69,95.78
N$137
  Bottom 0.508: R250.1 118.31,90.17 126.47,90.17 127.79,91.49 138.76,91.49 140.44,93.17 149.48,93.17 152.07,95.76 LED7.A
N$162
  Bottom 0.508: S10.4 107.92,70.48 R257.1
N$163
  Top 0.508: IC17.14 87.6,19.81 90.91,23.11 90.91,34.54 94.72,38.35 123.67,38.35 123.67,52.43 R218.1
  Bottom 0.508: 123.67,52.32 R218.1 123.98,52.63 S9.3
N$164
  Top 0.508: IC17.13 87.6,17.27 92.18,21.84 92.18,34.04 95.48,37.34 155.93,37.34 155.93,58.01 S8.3
N$165
  Top 0.508: IC17.12 87.86,14.73 93.45,20.32 93.45,33.53 96.24,36.32 171.93,36.32 171.93,52.58 171.91,52.58 R225.1
  Bottom 0.508: 171.91,52.58 171.81,52.58 | R225.1 171.91,52.58 | S7.3 171.98,52.58 171.91,52.58
N$166
  Bottom 0.508: S11.4 89.61,70.51 R259.1
N$167
  Bottom 0.508: IC18.14 110.97,19.81 110.97,29.21 123.67,29.21 125.7,31.24 125.7,35.05 128.5,37.85 193.52,37.85 196.32,40.64 | 196.32,40.64 228.07,40.64 228.07,56.39 224.97,59.49 S5.4 | 196.32,40.64 196.32,43.03 194.54,44.81 | 194.54,44.81 R230.1 | 194.54,44.81 194.54,44.83
N$168
  Bottom 0.508: D3.C 121.89,101.58 121.89,103 S4.P$1
N$169
  Bottom 0.508: IC18.12 113.51,14.73 113.51,26.67 124.69,26.67 128.24,30.23 128.24,34.04 129.26,35.05 | 225.02,33.38 225.02,33.27 | 225.02,33.38 S15.1 | 217.4,38.1 220.45,38.1 | 220.45,38.1 225.02,38.1 225.02,33.38 | 217.4,38.1 197.59,38.1 195.3,35.81 130.02,35.81 129.26,35.05 | 217.4,38.1 213.08,38.1 | 129.26,35.05 128.5,34.29 | R232.1 212.98,38.1 220.45,38.1
N$170
  Bottom 0.508: R206.1 arc-90 39.09,44.96 arc-90 38.48,44.35 S26.2
N$171
  Bottom 0.508: S27.3 12.98,31.8 12.93,31.75 29.97,14.71 IC16.5
N$172
  Bottom 0.508: IC17.9 87.35,5.59 105.38,5.59 105.38,7.62 107.42,9.65 IC18.10
N$173
  Bottom 0.508: 158.47,44.7 158.5,44.73 R224.1 158.5,44.7 158.47,44.7 | S18.4 158.83,44.35 158.47,44.7 | IC18.4 98.53,17.27 96.75,19.05 96.75,33.53 99.03,35.81 123.42,35.81 127.48,39.88 155.68,39.88 158.47,42.67 158.47,44.7
N$174
  Top 0.508: IC17.4 76.68,17.27 70.33,23.62 70.33,34.29 76.94,40.89 90.65,40.89 91.67,41.91 91.67,48.51 90.4,49.78 90.4,56.39 92.02,58.01 | 92.02,58.01 92.18,58.17 | 92.02,58.01 S11.3
N$175
  Bottom 0.508: 124.56,104.14 124.69,104.14 | D4.C 124.56,104.14 | S4.P$2 123.29,104.14 124.56,104.14
N$176
  Bottom 0.508: 55.14,45.01 55.35,45.21 | 55.14,45.01 R209.1 | S25.2 54.48,44.35 55.14,45.01
  Bottom 0.762: S25.2 49.96,44.2
N$177
  Bottom 0.508: IC4.5 199.92,76.68 199.92,82.19 213.13,82.19 219.53,88.59 219.53,95.66 219.23,95.96 | 219.23,95.96 219.18,96.01 | 219.23,95.96 R234.1
N$181
  Bottom 0.508: IC5.9 129.77,83.01 129.77,74.3 78.36,74.3 78.36,77.24 | 78.36,77.24 78.36,77.32 | 78.36,77.24 IC7.14
N$182
  Bottom 0.508: IC5.6 147.85,77.93 157.61,87.68 167.61,87.68 R243.2
N$183
  Bottom 0.508: IC5.7 148.01,80.47 157.56,90.02 159.54,90.02 R244.2
N$184
  Bottom 0.508: IC5.5 148.21,75.39 156.44,83.62 167.41,83.62 R242.1
N$185
  Bottom 0.508: IC7.15 80.87,80.06 103.1,80.06 106.43,83.39 R250.2
N$186
  Bottom 0.508: IC7.2 80.87,82.04 102.59,82.04 R251.1
N$187
  Bottom 0.508: R234.2 220.5,109.98 223.75,109.98 225.27,111.51 225.27,113.28 223.75,114.81 219.94,114.81 215.62,119.13 215.62,125.98 214.6,127 214.6,129.79 215.62,130.81 215.62,135.38 LED1.A
N$188
  Bottom 0.508: 215.49,95.86 215.32,95.86 | 215.49,95.86 LED2.A | R237.2 215.7,95.86 215.49,95.86
N$189
  Bottom 0.508: IC7.3 78.33,87.17 102.44,87.17 106.71,91.44 | 106.71,91.44 106.81,91.54 | 106.71,91.44 R253.1
N$190
  Bottom 0.508: IC7.4 75.79,86.59 77.95,88.75 93.8,88.75 96.19,91.14 | 96.19,91.14 96.24,91.19 | 96.19,91.14 R256.1
N$191
  Bottom 0.508: LED14.A 62.92,95.76 63.12,95.56 R262.1
N$192
  Bottom 0.508: IC8.3 35.79,77.27 37.21,75.84 47.68,75.84 49.83,78 R264.1
N$193
  Bottom 0.508: IC8.6 33.65,84.89 39.24,90.47 41.17,90.47 R267.1
N$194
  Bottom 0.508: R268.1 28.42,94.06 28.42,88.65 29.64,87.43 31.57,87.43 | 31.57,87.43 IC8.7 | 31.57,87.43 31.78,87.63
N$195
  Bottom 0.508: IC8.5 33.91,82.35 38.94,87.38 45.34,87.38 R266.2
N$196
  Bottom 0.508: R223.1 146.91,60.83 146.79,60.83 146.79,64.44 IC5.1
N$197
  Bottom 0.508: IC8.4 33.91,79.81 37.92,83.82 45.24,83.82 45.24,83.74 R265.1
N$198
  Bottom 0.508: 143.13,60.76 143.13,60.66 | R222.2 143.13,60.76 | IC5.2 143.13,67.77 143.13,60.76
N$199
  Bottom 0.508: IC5.15 140.94,67.77 140.94,64.11 139.27,62.43 139.27,60.73 | 139.27,60.73 139.27,60.71 | R221.1 139.27,60.73
N$200
  Bottom 0.508: IC5.4 148.51,72.85 151.16,75.49 161.72,75.49 164.67,72.54 164.72,72.59 R246.1
N$201
  Bottom 0.508: R245.2 168.53,63.75 148.72,63.75 148.72,70.31 IC5.3 145.97,70.31
N$202
  Bottom 0.508: IC4.3 196.72,71.6 196.72,67.31 214.5,67.31 214.5,69.95 R238.2
N$203
  Bottom 0.508: IC4.4 198.55,74.14 198.55,68.94 211,68.94 211,72.62 R239.2
N$204
  Bottom 0.508: 192.86,62.23 192.86,62.28 R229.1 193.01,66.52 IC4.1
N$205
  Bottom 0.508: R261.1 70.82,91.39 70.71,91.29 IC7.6
N$206
  Bottom 0.508: R262.2 67.13,90.47 67.08,90.42 68.17,89.33 IC7.7
N$207
  Bottom 0.508: IC7.5 73.25,86.23 78.16,91.14 83.44,91.14 R260.1
N$208
  Bottom 0.508: IC4.2 189.66,69.06 189.66,62.74 | 189.66,62.74 189.66,62.43 | 189.66,62.74 189.71,62.74 R228.2
N$209
  Bottom 0.508: IC4.15 187.68,69.06 187.68,65.43 185.95,63.7 185.95,62.1 | 185.95,62.1 185.95,62.03 | 185.95,62.1 R227.1
N$210
  Bottom 0.406: R203.1 24.18,68.28 24.18,69.29 24.21,69.29
  Bottom 0.508: IC8.15 26.24,74.73 26.24,71.32 24.21,69.29
N$211
  Bottom 0.508: R205.1 30.56,68.12 30.51,68.12 30.51,71.25 IC8.1
N$212
  Bottom 0.508: IC8.2 28.52,74.73 28.52,69.49 27.46,68.43 R204.2
N$213
  Bottom 0.508: IC6.15 69.77,65.79 67.54,65.79 61.44,59.69 61.44,54.61 58.7,51.87 | 58.7,51.87 58.65,51.82 | R208.1 58.7,51.87
N$214
  Bottom 0.508: 81.46,51.89 81.46,51.87 | 81.46,51.89 R211.1 | 81.46,51.89 81.46,53.75 67.28,53.75 67.28,60.91 | 67.28,60.91 67.28,60.96 | 67.28,60.91 IC6.1
N$215
  Bottom 0.508: 97.56,51.84 97.56,51.77 | 97.56,51.84 R213.1 | 97.56,51.84 97.56,53.65 84.05,53.65 82.52,55.17 69.82,55.17 69.82,60.91 | 69.82,60.91 69.82,60.96 | 69.82,60.91 IC6.2
N$216
  Bottom 0.508: R215.1 113.41,51.71 113.41,53.59 100.05,53.59 98.53,55.12 84.86,55.12 83.59,56.39 72.36,56.39 72.36,60.91 | 72.36,60.91 72.36,60.96 | 72.36,60.91 IC6.3
N$217
  Bottom 0.508: 118.52,63.45 118.59,63.45 | 118.52,63.45 R217.2 | 118.52,63.45 106.15,63.45 105.44,62.74 91.72,62.74 87.1,58.12 74.9,58.12 74.9,60.91 | 74.9,60.91 74.9,60.96 | 74.9,60.91 IC6.4
N$218
  Bottom 0.508: 120.57,72.54 R248.1 120.62,72.52 | 120.62,72.52 120.62,72.54 | 120.62,72.52 120.62,72.34 113.97,65.68 105.44,65.68 103.96,64.21 88.42,64.21 87.6,63.4 82.52,63.4 82.52,60.91 IC6.7
N$219
  Bottom 0.508: 116.31,72.54 116.31,72.52 R249.2 116.26,72.49 116.26,69.6 113.87,67.21 104.77,67.21 103.3,65.73 87.81,65.73 86.79,64.72 79.98,64.72 79.98,60.91 IC6.6
N$220
  Bottom 0.508: 102.49,72.69 102.49,72.62 R258.1 102.59,72.54 | 102.59,72.54 102.59,72.59 | 102.59,72.54 102.59,67.26 87.2,67.26 86.03,66.09 77.44,66.09 77.44,60.91 IC6.5
N$221
  Bottom 0.508: IC16.9 63.83,5.59 83.29,5.59 83.29,7.37 85.57,9.65 IC17.10
N$222
  Bottom 0.508: S22.4 94.56,44.35 94.21,44.7 | IC16.13 63.96,17.25 69.82,23.11 69.82,34.8 75.92,40.89 90.4,40.89 94.21,44.7 | 94.21,44.7 R214.1
N$223
  Bottom 0.508: 61.93,44.86 61.82,44.96 | R210.1 61.93,44.86 | S24.4 62.43,44.35 61.93,44.86
N$224
  Bottom 0.508: IC16.11 63.96,12.17 74.65,22.86 74.65,27.43 78.97,31.75 84.05,31.75 | 84.05,31.75 83.97,31.75 S23.3 84.05,31.77 84.05,31.75
N$226
  Bottom 0.508: S26.1 33.96,31.8 48.51,17.25 IC16.4
  Bottom 0.762: S26.1 33.96,31.55
N$227
  Bottom 0.508: R219.1 126.21,44.96 | S20.4 126.82,44.35 R219.1 | IC18.6 98.53,12.19 94.21,16.51 94.21,34.04 98.02,37.85 119.35,37.85 126.39,44.88 | 126.39,44.88 126.47,44.96 | 126.39,44.88 R219.1
N$228
  Bottom 0.508: 110.39,44.78 110.34,44.83 | 110.39,44.78 R216.1 110.52,44.76 110.46,44.7 | S21.4 110.82,44.35 110.46,44.7 | 110.46,44.7 110.39,44.78 | IC16.12 63.58,14.71 71.09,22.23 71.09,33.27 76.94,39.12 92.43,39.12 94.46,41.15 106.91,41.15 110.46,44.7
N$229
  Bottom 0.508: 208.51,75.06 208.51,75.18 | 208.51,75.06 R240.1 | S6.2 208.51,74.62 208.51,75.06
N$230
  Bottom 0.508: IC16.14 63.7,19.79 68.05,24.13 68.05,31.77 S24.3
N$233
  Bottom 0.508: 13,44.32 13.06,44.32 | 13,44.32 S27.4 | R201.1 10.11,44.32 13,44.32
N$234
  Bottom 0.508: R235.1 215.62,111.25 216.72,112.36 S2.A 216.72,114.47 213.08,118.11 213.08,123.44 208,128.52 208,131.57 206.22,133.35 205.49,133.35 | 205.49,133.35 205.46,133.35 | 205.49,133.35 R270.1
N$235
  Bottom 0.508: R212.1 78.33,44.83 78.82,44.35 S23.4
N$238
  Bottom 0.508: R252.1 116.08,93.32 124.23,93.32 126.62,95.71 126.59,95.73 LED9.A
N$239
  Bottom 0.508: LED10.A 113.87,95.76 113.87,93.55 R253.2
N$240
  Bottom 0.508: LED11.A 101.19,95.63 101.17,95.61 101.24,95.53 R256.2
N$241
  Bottom 0.508: LED12.A 88.47,95.76 88.54,95.68 R260.2
N$242
  Bottom 0.508: S19.4 143.08,44.35 142.72,44.7 | 142.72,44.7 142.6,44.83 R220.1 142.62,44.81 142.72,44.7 | IC18.5 98.53,14.73 95.48,17.78 95.48,33.78 98.53,36.83 122.91,36.83 126.97,40.89 138.91,40.89 142.72,44.7
N$244
  Bottom 0.508: R231.1 210.57,47.47 210.54,47.5 208.91,45.87 S16.2
N$245
  Bottom 0.508: S14.3 12.98,58.85 10.64,56.52 | 10.64,56.52 10.52,56.39 R202.1 10.54,56.41 10.64,56.52 | IC16.6 29.08,12.17 6.2,35.05 6.2,52.07 10.64,56.52
  Bottom 0.762: S14.3 13.03,59.54
N$246
  Bottom 0.508: S13.2 41.96,70.54 41.88,70.61 44.58,73.3 R263.1
N$247
  Bottom 0.508: Q5.2 106.65,106.17 108.94,108.46 S4.C
N$248
  Top 0.508: IC17.6 76.68,12.19 65.51,23.37 65.51,26.92 55.09,37.34 41.88,37.34 41.88,58.01 | 41.88,58.01 41.88,58.17 | 41.88,58.01 S13.1
N$249
  Bottom 0.508: S17.4 175.08,44.35 174.6,44.83 R226.1 174.73,44.88 | IC18.3 98.65,19.81 97.89,20.57 97.89,33.15 99.54,34.8 123.93,34.8 127.99,38.86 172.95,38.86 174.73,40.64 174.73,44.88 | 174.73,44.88 174.73,44.96
N$251
  Top 0.508: IC17.3 76.68,19.81 75.16,21.34 75.16,34.04 80.75,39.62 107.67,39.62 107.67,48.51 106.4,49.78 106.4,56.39 107.98,57.96 S10.3
N$252
  Bottom 0.508: 37.67,95.76 37.46,95.96 | LED16.A 37.67,95.76 | R267.2 37.85,95.58 37.67,95.76
N$253
  Top 0.508: IC17.11 87.35,12.19 94.72,19.56 94.72,33.02 97,35.31 186.92,35.31 186.92,45.97 195.81,54.86 205.97,54.86 205.97,59.54 S6.1
N$254
  Bottom 0.508: IC18.11 114.78,12.19 114.78,25.4 125.2,25.4 129.51,29.72 129.51,33.53 130.78,34.8 181.33,34.8 | 205.97,33.38 205.97,33.27 | 205.97,33.38 S16.1 | 205.97,33.38 205.97,36.83 198.35,36.83 196.32,34.8 181.33,34.8 | 181.33,34.8 176.5,34.8
N$255
  Bottom 0.508: 50.01,31.85 50.01,32 | 50.01,31.85 S25.1 | IC16.3 50.01,19.79 50.01,31.85
N$256
  Bottom 0.508: 153.29,72.49 153.24,72.49 | R247.1 153.29,72.49 | S8.4 154,72.49 153.29,72.49
N$258
  Bottom 0.508: 202.79,95.86 202.67,95.86 | 202.79,95.86 LED3.A | R241.2 203.02,95.86 202.79,95.86
N$259
  Bottom 0.508: R242.2 181.94,93.12 187.48,93.12 190.12,95.76 LED4.A
N$260
  Bottom 0.508: LED5.A 177.42,95.76 172.64,90.98 R243.1
N$261
  Bottom 0.508: 50.37,95.76 50.27,95.86 | 50.37,95.76 LED15.A | R266.1 50.44,95.68 50.37,95.76
N$263
  Bottom 0.508: R251.2 117.32,91.69 125.55,91.69 127.03,93.17 136.68,93.17 139.29,95.78 | 139.29,95.78 139.32,95.81 | 139.29,95.78 LED8.A
N$264
  Bottom 0.508: LED13.A 75.79,95.73 75.84,95.68 R261.2
N$266
  Bottom 0.508: IC4.9 178.08,84.3 178.08,74.52 166.78,74.52 166.78,67.39 150.6,67.39 150.6,71.6 143.54,71.6 142.21,70.28 138.35,70.28 | 138.35,70.28 138.23,70.28 | 138.35,70.28 IC5.14
N$267
  Bottom 0.508: IC7.9 65.63,76.33 72.36,69.6 72.36,68.48 | 72.36,68.48 72.36,68.33 | IC6.14 72.36,68.48
N$268
  Top 0.508: 23.83,77.17 23.65,77.17 | 23.83,77.17 IC8.14 | 23.83,77.17 27.58,77.17 27.58,70.05 32.51,70.05 38.25,75.79 59.92,75.79 59.92,71.68 85.06,71.68 85.06,68.53 IC6.9
N$269
  Bottom 0.508: LED17.A 24.92,95.76 29.51,100.36 R268.2
N$270
  Bottom 0.508: 214.5,75.03 R238.1 223.75,75.03 LED18.A
N$271
  Bottom 0.508: 204.7,77.88 204.55,77.88 | LED19.A 204.7,77.88 | R239.1 211.05,77.88 204.7,77.88
N$272
  Bottom 0.508: R245.1 169.9,75.95 175.79,75.95 175.79,77.98 LED20.A
N$273
  Bottom 0.508: LED21.A 159.69,77.98 159.69,77.67 R246.2
N$274
  Bottom 0.508: R248.2 122.89,79.86 127.63,79.86 127.63,77.98 | 127.63,77.98 127.63,77.93 | 127.63,77.98 LED22.A
N$275
  Bottom 0.508: LED23.A 111.68,77.93 111.68,77.88 115.98,77.88 R249.1
N$276
  Bottom 0.508: LED24.A 95.73,77.88 102.31,77.88 R258.2
N$277
  Bottom 0.508: 56.57,77.98 56.57,77.83 | 56.57,77.98 LED25.A | R265.2 56.57,83.69 56.57,77.98
N$278
  Bottom 0.508: 40.61,77.98 40.56,77.93 | LED26.A 40.61,77.98 | R264.2 40.64,78 40.61,77.98
N$279
  Bottom 0.508: R203.2 21.16,63.2 15.93,68.43 15.93,74.68 16.69,75.44 16.69,77.93 LED27.A
N$280
  Bottom 0.508: LED28.A 223.85,51.71 223.9,51.71 223.9,54.15 221.46,56.59 221.46,56.64 193.01,56.64 R229.2
N$281
  Bottom 0.508: 204.75,51.71 204.75,51.82 LED29.A 204.6,51.82 | 204.6,51.82 204.6,51.71 | 204.6,51.82 204.6,54.86 | 204.6,54.86 204.7,54.86 | R228.1 189.71,54.86 204.6,54.86
N$282
  Bottom 0.508: 183.74,51.69 183.72,51.66 | LED30.A 183.74,51.69 | R227.2 185.9,53.85 183.74,51.69
N$283
  Bottom 0.508: LED31.A 167.72,51.82 167.72,53.85 154.36,53.85 152.48,55.73 R223.2 146.91,55.75
N$284
  Bottom 0.508: R222.1 143.15,53.59 151.76,53.59 151.76,51.82 | 151.76,51.82 151.76,51.71 | 151.76,51.82 LED32.A
N$285
  Bottom 0.508: 135.71,51.79 135.71,51.77 | LED33.A 135.71,51.79 | R221.2 135.71,52.2 135.71,51.79
N$286
  Bottom 0.508: 119.76,51.79 119.76,51.77 | LED34.A 119.76,51.79 | R217.1 119.76,57.07 119.76,51.79
N$287
  Bottom 0.508: R215.2 108.38,51.82 LED35.A
N$288
  Bottom 0.508: 87.45,51.82 87.4,51.77 | LED36.A 87.45,51.82 | R213.2 87.48,51.84 87.45,51.82
N$289
  Bottom 0.508: 71.73,51.79 71.6,51.66 | LED37.A 71.73,51.79 | R211.2 71.83,51.89 71.73,51.79
N$290
  Bottom 0.508: 48.64,51.82 48.59,51.77 | LED38.A 48.64,51.82 | R208.2 48.69,51.87 48.64,51.82
N$291
  Bottom 0.508: 32.69,51.77 32.69,51.71 | LED39.A 32.69,51.77 | R205.2 32.69,60.96 32.69,51.77
N$292
  Bottom 0.508: 16.79,51.77 16.79,51.66 | LED40.A 16.79,51.77 | R204.1 16.79,52.76 16.79,51.77
N$294
  Bottom 0.508: IC3.9 190.42,6.6 180.06,6.6 178.03,4.57 138.66,4.57 138.66,16.76 IC1.3 132.05,16.76 128.75,13.46 D2.A
N$295
  Bottom 0.508: D5.C 133.15,105.92 124.18,105.92 121.51,108.58 S4.P$4
N$297
  Bottom 0.508: D6.C 134.72,107.06 125.58,107.06 124.05,108.58 S4.P$8
N$298
  Bottom 0.508: D7.C 192.51,101.6 179.04,101.6 172.19,108.46 S3.P$1
N$299
  Bottom 0.508: D8.C 190.98,102.62 180.82,102.62 174.98,108.46 S3.P$2
N$300
  Bottom 0.508: D9.C 189.46,103.63 182.35,103.63 177.52,108.46 S3.P$4
N$301
  Bottom 0.508: S3.P$8 179.81,108.46 182.35,105.92 D10.C
N$305
  Bottom 0.508: J1.1 226.54,109.47 226.54,113.79 221.97,118.36 218.41,118.36 216.89,119.89 216.89,128.27 216.78,128.16 S2.SW1
N$306
  Bottom 0.508: 211.81,128.27 211.72,128.18 S2.SW2 | 211.56,128.52 210.57,129.51 R269.1 210.54,130.81 210.54,133.22 210.67,133.35 210.64,133.38 R270.2 | 211.81,128.27 211.56,128.52 | 211.56,128.52 211.72,128.36 S2.SW2 | J2.1 220.45,112.52 214.35,118.62 214.35,124.46 211.81,127 211.81,128.27 | 211.81,128.27 211.81,128.25 S2.SW2
N$307
  Bottom 0.762: IC3.18 213.28,12.45 219.43,12.45 220.95,10.92 XTL1.3
NOTE0
  Top 0.508: IC9.3 145.92,99.06 227.56,99.06 227.56,29.72 222.99,29.72 218.67,25.4 218.41,25.4 218.41,25.38 IC3.21
NOTE1
  Top 0.508: 215.87,25.38 215.87,25.4 | 215.87,25.38 IC3.22 | 215.87,25.38 215.87,24.13 217.4,22.61 218.92,22.61 225.02,28.7 228.57,28.7 228.57,100.08 151.66,100.08 | 151.66,100.08 151.61,100.08 | IC9.14 145.92,113.49 147.19,112.22 147.19,100.08 151.66,100.08
NOTE2
  Top 0.508: IC9.4 148.46,101.09 229.59,101.09 229.59,27.69 225.53,27.69 219.43,21.59 215.87,21.59 213.33,24.13 213.33,25.38 | 213.33,25.38 213.33,25.4 | 213.33,25.38 IC3.23
NOTE3
  Top 0.508: 210.69,102.11 230.61,102.11 230.61,26.67 226.03,26.67 219.94,20.57 214.1,20.57 210.79,23.88 210.79,25.4 210.79,25.38 IC3.24 | 210.69,102.11 209.78,102.11 | IC9.13 148.46,113.49 149.73,112.22 149.73,102.11 210.69,102.11
NOTE4
  Top 0.508: IC9.6 153.54,103.12 231.62,103.12 231.62,25.65 226.54,25.65 220.45,19.56 212.32,19.56 208.25,23.62 208.25,25.4 208.25,25.38 IC3.25
NOTE5
  Top 0.508: 211.2,104.14 210.54,104.14 | 211.2,104.14 232.64,104.14 232.64,17.02 222.22,17.02 220.7,18.54 210.54,18.54 205.71,23.37 205.71,25.4 205.71,25.38 IC3.26 | IC9.11 153.54,113.59 154.81,112.32 154.81,104.14 211.2,104.14
NOTE_LATCH
  Top 0.508: 198.09,25.38 198.09,25.4 | 198.09,25.38 IC3.29 | 198.09,25.38 198.09,22.1 204.7,15.49 218.92,15.49 220.45,13.97 235.69,13.97 235.69,107.44 231.88,107.44 222.73,116.59 159.99,116.59 IC9.9
ROTARY1
  Bottom 0.508: D3.A 130,100.58 158.98,100.58 168.88,110.49 180.82,110.49 183.36,107.95 196.82,107.95 | 196.82,107.95 D7.A | 196.82,107.95 198.09,107.95 205.46,100.58 231.11,100.58 231.11,27.18 225.78,27.18 219.68,21.08 188.19,21.08 185.39,23.88 185.39,25.38 | 185.39,25.38 185.39,25.4 | 185.39,25.38 IC3.34
ROTARY2
  Bottom 0.508: D4.A 133.96,101.6 158.22,101.6 168.12,111.51 181.33,111.51 183.87,108.97 190.22,108.97 D8.A 196.06,114.81 197.59,114.81 198.6,113.79 198.6,108.97 205.97,101.6 | 205.97,101.6 229.34,101.6 | 205.97,101.6 232.13,101.6 232.13,26.16 226.29,26.16 220.19,20.07 186.66,20.07 182.85,23.88 182.85,25.4 182.85,25.38 IC3.35
ROTARY4
  Bottom 0.508: D5.A 158.52,103.68 167.36,112.52 181.84,112.52 184.38,109.98 188.7,109.98 D9.A 194.54,115.82 198.09,115.82 199.62,114.3 199.62,109.47 206.48,102.62 | 206.48,102.62 230.86,102.62 | 233.15,25.65 233.15,28.45 | 233.15,25.65 233.15,16.51 223.75,16.51 221.21,19.05 184.89,19.05 180.31,23.62 180.31,25.4 180.31,25.38 IC3.36 | 206.48,102.62 233.15,102.62 233.15,25.65
ROTARY8
  Bottom 0.508: D6.A 159.41,106.35 166.6,113.54 182.6,113.54 184.38,111.76 187.93,111.76 D10.A 193.01,116.84 198.6,116.84 200.63,114.81 200.63,109.98 206.98,103.63 | 206.98,103.63 231.62,103.63 | 234.16,24.13 234.16,29.21 | 234.16,24.13 234.16,15.49 222.99,15.49 220.45,18.03 183.11,18.03 177.77,23.37 177.77,25.4 177.77,25.38 IC3.37 | 206.98,103.63 234.16,103.63 234.16,24.13
ROTARYCOM3
  Bottom 0.508: R254.2 121.26,99.57 169.65,99.57 | 169.65,99.57 227.81,99.57 | S3.C 169.65,108.46 169.65,99.57 | 169.65,99.57 230.1,99.57 230.1,28.19 225.27,28.19 219.18,22.1 189.71,22.1 187.93,23.88 187.93,25.27 IC3.33
SLIDE
  Top 0.508: 202.67,112.01 205.71,108.97 211.56,108.97 212.83,107.7 217.4,107.7 219.94,105.16 233.65,105.16 233.65,16 230.86,16 221.72,16 220.19,17.53 208.76,17.53 203.17,23.11 203.17,25.38 | 203.17,25.38 203.17,25.4 | 203.17,25.38 IC3.27
SPI_CLK  (via drill 0.6)
  Top 0.508: IC8.11 26.64,84.89 26.64,92.96 34.01,92.96 37.06,89.92 37.06,85.6 41.12,81.53 58.14,81.53 63.47,76.2 63.47,74.42 70.59,74.42 | IC7.11 70.84,77.24 70.84,74.42 70.59,74.42 | 70.59,74.42 v75.92,74.42 84.05,74.42 85.32,75.69 132.05,75.69 134.29,77.93 IC5.11 138.38,77.98 141.2,77.98 141.2,86.36 153.64,86.36 154.41,85.6 177.77,85.6 184.15,79.22 IC4.11 185.14,79.25 189.97,79.25 189.97,65.02 211.05,65.02 211.05,51.82 208.25,49.02 208.25,43.69 206.98,42.42 205.46,42.42 194.23,31.19 194.23,22.05 187.88,15.7 187.93,15.65 187.93,10.03 | IC17.2 81,22.35 81,6.35 | 81,6.35 81,4.06 | 103.1,22.35 103.1,3.81 | 57.38,22.33 IC16.2 | 57.38,22.33 57.38,3.3 | IC2.6 157.45,14.22 157.45,2.03 103.1,2.03 | 81.25,2.03 81,2.03 81,6.35 | 103.1,2.03 81.25,2.03 | 57.38,22.33 57.38,2.03 81.25,2.03 | 103.1,22.35 IC18.2 | 103.1,2.03 103.1,22.35 | 187.93,10.03 187.93,9.91 | 187.93,10.03 IC3.8
  Bottom 0.508: IC6.11 79.93,70.41 v75.92,74.42 | IC3.8 187.93,10.08 187.93,14.22 IC2.6
SPI_IN
  Top 0.508: 182.8,10.92 182.8,14.17 191.69,23.06 191.69,32.46 203.68,44.45 203.68,47.5 209.52,53.34 209.52,64.01 187.93,64.01 187.93,71.63 185.14,71.63 IC4.14 | 182.8,10.92 IC3.6 | 182.8,10.92 182.85,10.92
  Bottom 0.508: IC2.5 164.95,11.68 166.09,12.83 182.85,12.83 182.85,10.08 IC3.6
SPI_OUT
  Bottom 0.508: IC3.7 185.34,7.62 155.3,7.62 155.3,16.76 IC2.2 | IC2.2 152.25,16.76 | IC2.2 150.72,16.76 147.04,13.08 147.04,6.6 IC1.8
SWITCH_LATCH  (via drill 0.6)
  Top 0.508: IC18.1 105.38,24.89 v105.38,3.81 145.26,3.81 145.26,11.68 IC1.10 | IC17.1 83.29,24.89 v83.29,3.81 | 59.66,3.56 v59.66,3.81 59.66,24.87 IC16.1
  Bottom 0.508: v105.38,3.81 v83.29,3.81 v59.66,3.81 | IC3.1 157.45,10.08 157.45,19.3 IC2.1 150.47,19.3 145.14,13.97 145.14,11.68 IC1.10
TEMPO_SW
  Bottom 0.508: 226.54,83.06 229.08,80.52 229.08,39.37 196.82,39.37 194.28,36.83 182.6,36.83 | 226.54,83.06 225.48,84.12 | 225.53,85.09 225.53,84.07 226.54,83.06 | 225.53,85.09 J1.2 | 225.53,85.09 R233.1 | IC18.13 112.24,17.27 112.24,27.94 124.18,27.94 126.97,30.73 126.97,34.54 129.26,36.83 182.6,36.83 | 182.6,36.83 181.33,36.83
TEMPO_SW_A
  Bottom 0.508: 175.23,25.4 175.23,25.38 IC3.38 | 175.23,25.4 175.23,23.11 181.33,17.02 219.94,17.02 222.48,14.48 235.18,14.48 235.18,104.65 216.94,104.65 R235.2 | 175.23,25.4 175.23,27.69 C100.2
TEMPO_SW_B
  Bottom 0.508: 172.69,25.4 172.69,25.38 IC3.39 | 172.69,25.4 172.69,22.86 179.55,16 219.18,16 221.72,13.46 236.19,13.46 236.19,105.66 220.45,105.66 217.65,108.46 210.03,108.46 R236.2 | 172.69,25.4 172.69,26.92 C101.2
USB_TX
  Top 1.016: IC3.4 177.72,8.18 178.54,7.37 185.39,7.37 J3.2
USBRX
  Top 1.016: IC3.3 175.18,7.92 179.04,4.06 J3.1
XTL1
  Bottom 0.762: IC3.19 215.87,10.03 XTL1.1

## Text on the board
tPlace: x0xb0x v1.0 | Adafruit Industries | http://www.ladyada.net